# Altium project holoboard.PrjPCB
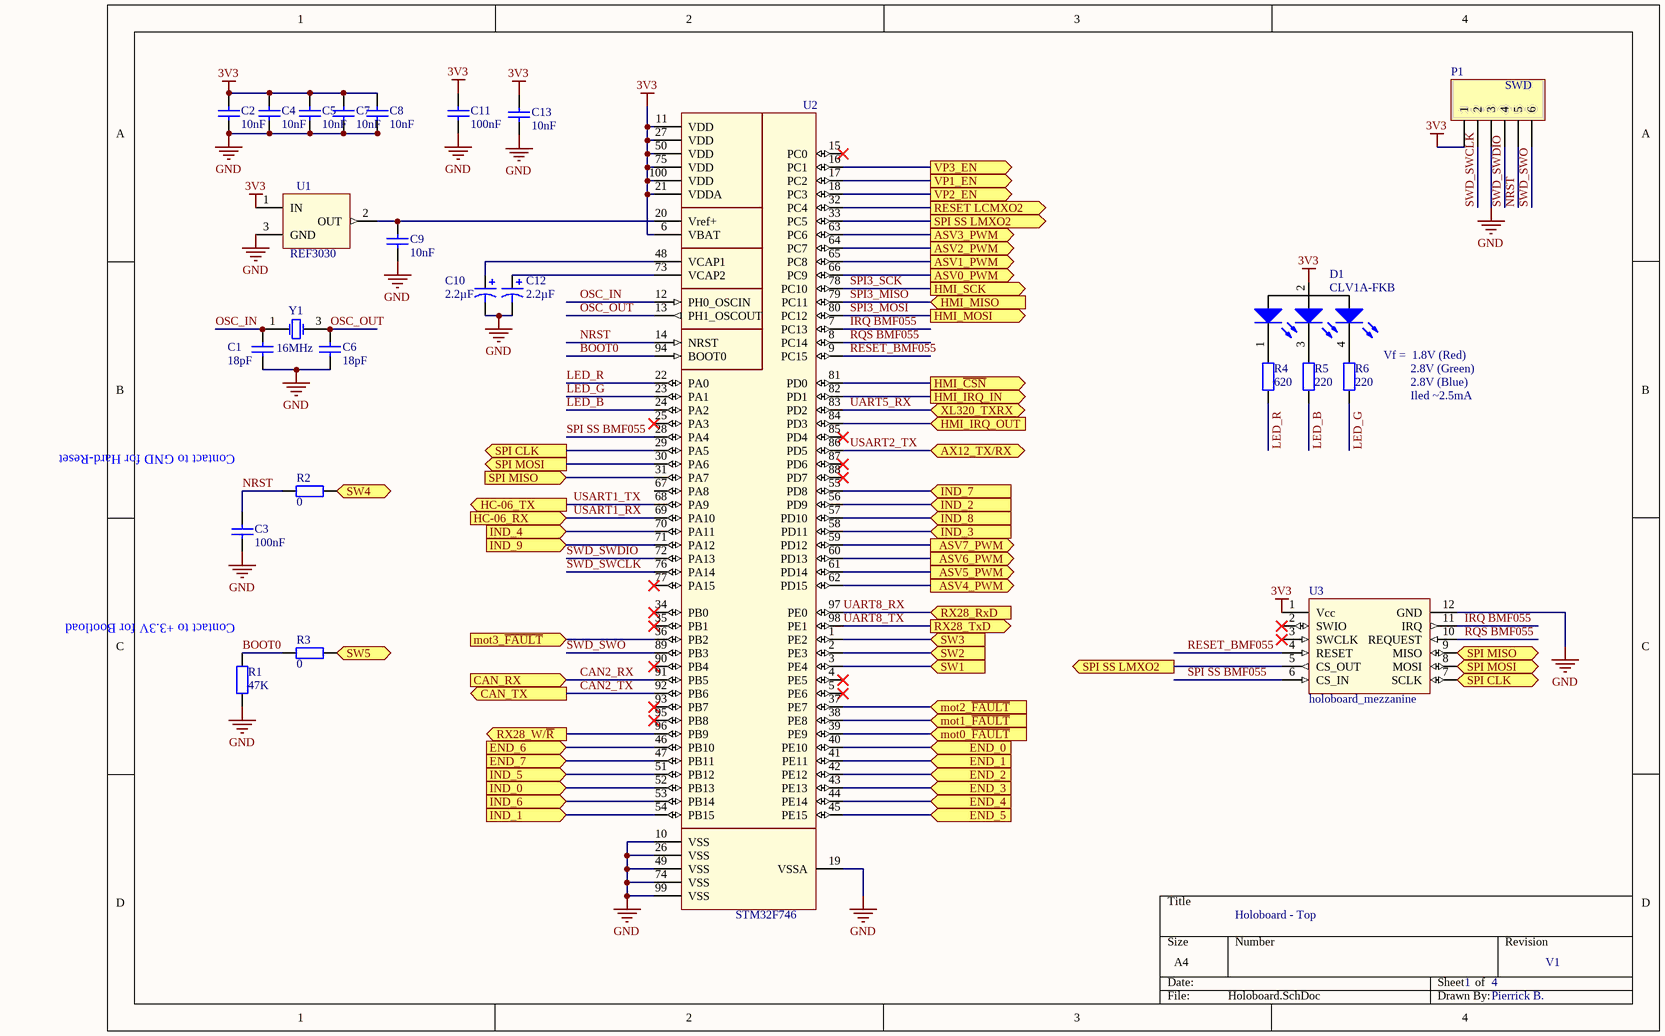
[diagram p0: Holoboard.SchDoc]
4 sheets, 203 parts. Net scope: flat (ports and power ports of the same name join across sheets).
Board file: holoboard.PcbDoc
Sheets:
  Holoboard.SchDoc
  Holoboard_motor_interface.SchDoc
  Holoboard_peripherals.SchDoc
  Holoboard_power_supply.SchDoc

## Sheet Holoboard.SchDoc
size A4

### Parts
C1  value 18pF  [C0603]  (hidden comment: Cap)
C2  value 10nF  [C0603]  (hidden comment: Cap)
C3  value 100nF  [C0603]  (hidden comment: Cap)
C4  value 10nF  [C0603]  (hidden comment: Cap)
C5  value 10nF  [C0603]  (hidden comment: Cap)
C6  value 18pF  [C0603]  (hidden comment: Cap)
C7  value 10nF  [C0603]  (hidden comment: Cap)
C8  value 10nF  [C0603]  (hidden comment: Cap)
C9  value 10nF  [C0603]  (hidden comment: Cap)
C10  value 2.2µF  [Boitier tantale A]  (hidden comment: Cap Pol)
C11  value 100nF  [C0603]  (hidden comment: Cap)
C12  value 2.2µF  [Boitier tantale A]  (hidden comment: Cap Pol)
C13  value 10nF  [C0603]  (hidden comment: Cap)
D1  CLV1A-FKB  [WL-SFTW SMD]
P1  SWD  [HDR1X6]
R1  value 47K  [0603]  (hidden comment: Res2)
R2  value 0  [0402]  (hidden comment: Res2)
R3  value 0  [0402]  (hidden comment: Res2)
R4  value 620  [0402]  (hidden comment: Res2)
R5  value 220  [0402]  (hidden comment: Res2)
R6  value 220  [0402]  (hidden comment: Res2)
U1  REF3030  [SOT-23]
U2  STM32F746  [LQFP100]
U3  holoboard_mezzanine  [holoboard_mezzanine]
Y1  16MHz  [QC3CA]

### Ports
ASV0_PWM (out), ASV1_PWM (out), ASV2_PWM (out), ASV3_PWM (out), ASV4_PWM (out), ASV5_PWM (out), ASV6_PWM (out), ASV7_PWM (out), AX12_TX/RX (bidir), CAN_RX (in), CAN_TX (out), END_0 (in), END_1 (in), END_2 (in), END_3 (in), END_4 (in), END_5 (in), END_6 (in), END_7 (in), HC-06_RX (in), HC-06_TX (out), HMI_IRQ_IN (out), HMI_IRQ_OUT (in), HMI_MISO (in), HMI_MOSI (out), HMI_SCK (out), HMI_~{CSN} (out), IND_0 (in), IND_1 (in), IND_2 (in), IND_3 (in), IND_4 (in), IND_5 (in), IND_6 (in), IND_7 (in), IND_8 (in), IND_9 (in), mot0_~{FAULT} (in), mot1_~{FAULT} (in), mot2_~{FAULT} (in), mot3_~{FAULT} (in), RESET LCMXO2 (out), RX28_RxD (in), RX28_TxD (out), RX28_W/~{R} (out), SPI CLK (in), SPI CLK (out), SPI MISO (in), SPI MISO (out), SPI MOSI (in), SPI MOSI (out), SPI SS LMXO2 (out), SW1 (in), SW2 (in), SW3 (in), SW4 (in), SW5 (in), VP1_EN (out), VP2_EN (out), VP3_EN (out), XL320_TXRX (bidir)

### Nets
3V3: C2.2 C4.2 C5.2 C7.2 C8.2 C11.2 C13.2 D1.2(A) P1.1 U1.1(IN) U2.6(VBAT) U2.11(VDD) U2.21(VDDA) U2.27(VDD) U2.50(VDD) U2.75(VDD) U2.100(VDD) U3.1(Vcc)
GND: C1.1 C2.1 C3.1 C4.1 C5.1 C6.1 C7.1 C8.1 C9.1 C10.2 C11.1 C12.2 C13.1 P1.3 R1.1 U1.3(GND) U2.10(VSS) U2.19(VSSA) U2.26(VSS) U2.49(VSS) U2.74(VSS) U2.99(VSS) U3.12(GND)
BOOT0: R1.2 R3.2 U2.94(BOOT0)
CAN2_RX: U2.91(PB5) ; port CAN_RX
CAN2_TX: U2.92(PB6) ; port CAN_TX
IRQ BMF055: U2.7(PC13) U3.11(IRQ)
LED_B: R5.1 U2.24(PA2)
LED_G: R6.1 U2.23(PA1)
LED_R: R4.2 U2.22(PA0)
NRST: C3.2 P1.5 R2.2 U2.14(NRST)
OSC_IN: C1.2 U2.12(PH0_OSCIN) Y1.1(OSC1)
OSC_OUT: C6.2 U2.13(PH1_OSCOUT) Y1.3(OSC2)
RESET_BMF055: U2.9(PC15) U3.4(RESET)
RQS BMF055: U2.8(PC14) U3.10(REQUEST)
SPI3_MISO: U2.79(PC11) ; port HMI_MISO
SPI3_MOSI: U2.80(PC12) ; port HMI_MOSI
SPI3_SCK: U2.78(PC10) ; port HMI_SCK
SPI SS BMF055: U2.28(PA4) U3.6(CS_IN)
SWD_SWCLK: P1.2 U2.76(PA14)
SWD_SWDIO: P1.4 U2.72(PA13)
SWD_SWO: P1.6 U2.89(PB3)
UART5_RX: U2.83(PD2) ; port XL320_TXRX
UART8_RX: U2.97(PE0) ; port RX28_RxD
UART8_TX: U2.98(PE1) ; port RX28_TxD
USART1_RX: U2.69(PA10) ; port HC-06_RX
USART1_TX: U2.68(PA9) ; port HC-06_TX
USART2_TX: U2.86(PD5) ; port AX12_TX/RX
NetC9_2: C9.2 U1.2(OUT) U2.20(Vref+)
NetC10_1: C10.1 U2.48(VCAP1)
NetC12_1: C12.1 U2.73(VCAP2)
NetD1_1: D1.1(R) R4.1
NetD1_3: D1.3(B) R5.2
NetD1_4: D1.4(G) R6.2
NetP18_2: U2.81(PD0) ; port HMI_~{CSN}
NetP18_3: U2.3(PE4) ; port SW1
NetP18_5: U2.2(PE3) ; port SW2
NetP18_7: U2.1(PE2) ; port SW3
NetP18_9: R2.1 ; port SW4
NetP18_10: U2.82(PD1) ; port HMI_IRQ_IN
NetP18_11: R3.1 ; port SW5
NetP18_12: U2.84(PD3) ; port HMI_IRQ_OUT
NetP24_4: U2.40(PE10) ; port END_0
NetP25_4: U2.41(PE11) ; port END_1
NetP26_4: U2.42(PE12) ; port END_2
NetP27_4: U2.43(PE13) ; port END_3
NetP28_4: U2.44(PE14) ; port END_4
NetP29_4: U2.45(PE15) ; port END_5
NetP30_4: U2.46(PB10) ; port END_6
NetP31_4: U2.47(PB11) ; port END_7
NetQ1_1: U2.17(PC2) ; port VP1_EN
NetQ2_1: U2.18(PC3) ; port VP2_EN
NetQ3_1: U2.16(PC1) ; port VP3_EN
NetR7_1: U2.39(PE9) ; port mot0_~{FAULT}
NetR8_1: U2.38(PE8) ; port mot1_~{FAULT}
NetR9_1: U2.37(PE7) ; port mot2_~{FAULT}
NetR10_1: U2.36(PB2) ; port mot3_~{FAULT}
NetR20_2: U2.52(PB13) ; port IND_0
NetR21_2: U2.54(PB15) ; port IND_1
NetR22_2: U2.56(PD9) ; port IND_2
NetR23_2: U2.58(PD11) ; port IND_3
NetR24_2: U2.70(PA11) ; port IND_4
NetR30_2: U2.51(PB12) ; port IND_5
NetR31_2: U2.53(PB14) ; port IND_6
NetR32_2: U2.55(PD8) ; port IND_7
NetR33_2: U2.57(PD10) ; port IND_8
NetR34_2: U2.71(PA12) ; port IND_9
NetR36_1: U2.66(PC9) ; port ASV0_PWM
NetR37_1: U2.65(PC8) ; port ASV1_PWM
NetR38_1: U2.64(PC7) ; port ASV2_PWM
NetR39_1: U2.63(PC6) ; port ASV3_PWM
NetR41_1: U2.62(PD15) ; port ASV4_PWM
NetR42_1: U2.61(PD14) ; port ASV5_PWM
NetR43_1: U2.60(PD13) ; port ASV6_PWM
NetR44_1: U2.59(PD12) ; port ASV7_PWM
NetR57_1: U2.33(PC5) U3.5(CS_OUT) ; port SPI SS LMXO2
NetU2_29: U2.29(PA5) U3.7(SCLK) ; port SPI CLK
NetU2_30: U2.30(PA6) U3.8(MOSI) ; port SPI MOSI
NetU2_31: U2.31(PA7) U3.9(MISO) ; port SPI MISO
NetU2_32: U2.32(PC4) ; port RESET LCMXO2
NetU2_96: U2.96(PB9) ; port RX28_W/~{R}

Not connected (* = marked no-connect by the designer): U2 4(PE5)* 5(PE6)* 15(PC0)* 25(PA3)* 34(PB0)* 35(PB1)* 67(PA8) 77(PA15)* 85(PD4)* 87(PD6)* 88(PD7)* 90(PB4)* 93(PB7)* 95(PB8)*; U3 2(SWIO)* 3(SWCLK)*; Y1 2 4

### Notes on the sheet
- Vf =  1.8V (Red)
- 2.8V (Green)
- 2.8V (Blue)
- (near R2) Contact to GND for Hard-Reset
- Iled ~2.5mA
- Contact to +3.3V for Bootload
- Holoboard - Top
- 1
- 4
- V1
- Pierrick B.

### Library data of the parts
C1-C9 C11 C13 = Cap: Capacitor; Published: 8-Jun-2000; LatestRevisionDate: 17-Jul-2002; LatestRevisionNote: Re-released for DXP Platform.; PackageReference: RAD-0.3; Publisher: Altium Limited; Supplier: FARNELL
C10 C12 = Cap Pol: Polarized Capacitor; Published: 8-Jun-2000; LatestRevisionDate: 17-Jul-2002; LatestRevisionNote: Re-released for DXP Platform.; PackageReference: POLAR0.8; Publisher: Altium Limited; Supplier: FARNELL
P1 = Header 6: Header, 6-Pin; Supplie: FARNELL
R1-R6 = Res2: Resistor; Published: 8-Jun-2000; LatestRevisionDate: 17-Jul-2002; LatestRevisionNote: Re-released for DXP Platform.; PackageReference: AXIAL-0.4; Publisher: Altium Limited; Supplier: FARNELL
Y1 = XTAL_4pins: Crystal Oscillator; Published: 8-Jun-2000; LatestRevisionDate: 17-Jul-2002; LatestRevisionNote: Re-released for DXP Platform.; PackageReference: R38; Publisher: Altium Limited; Supplier: FARNELL

## Sheet Holoboard_motor_interface.SchDoc
size A3
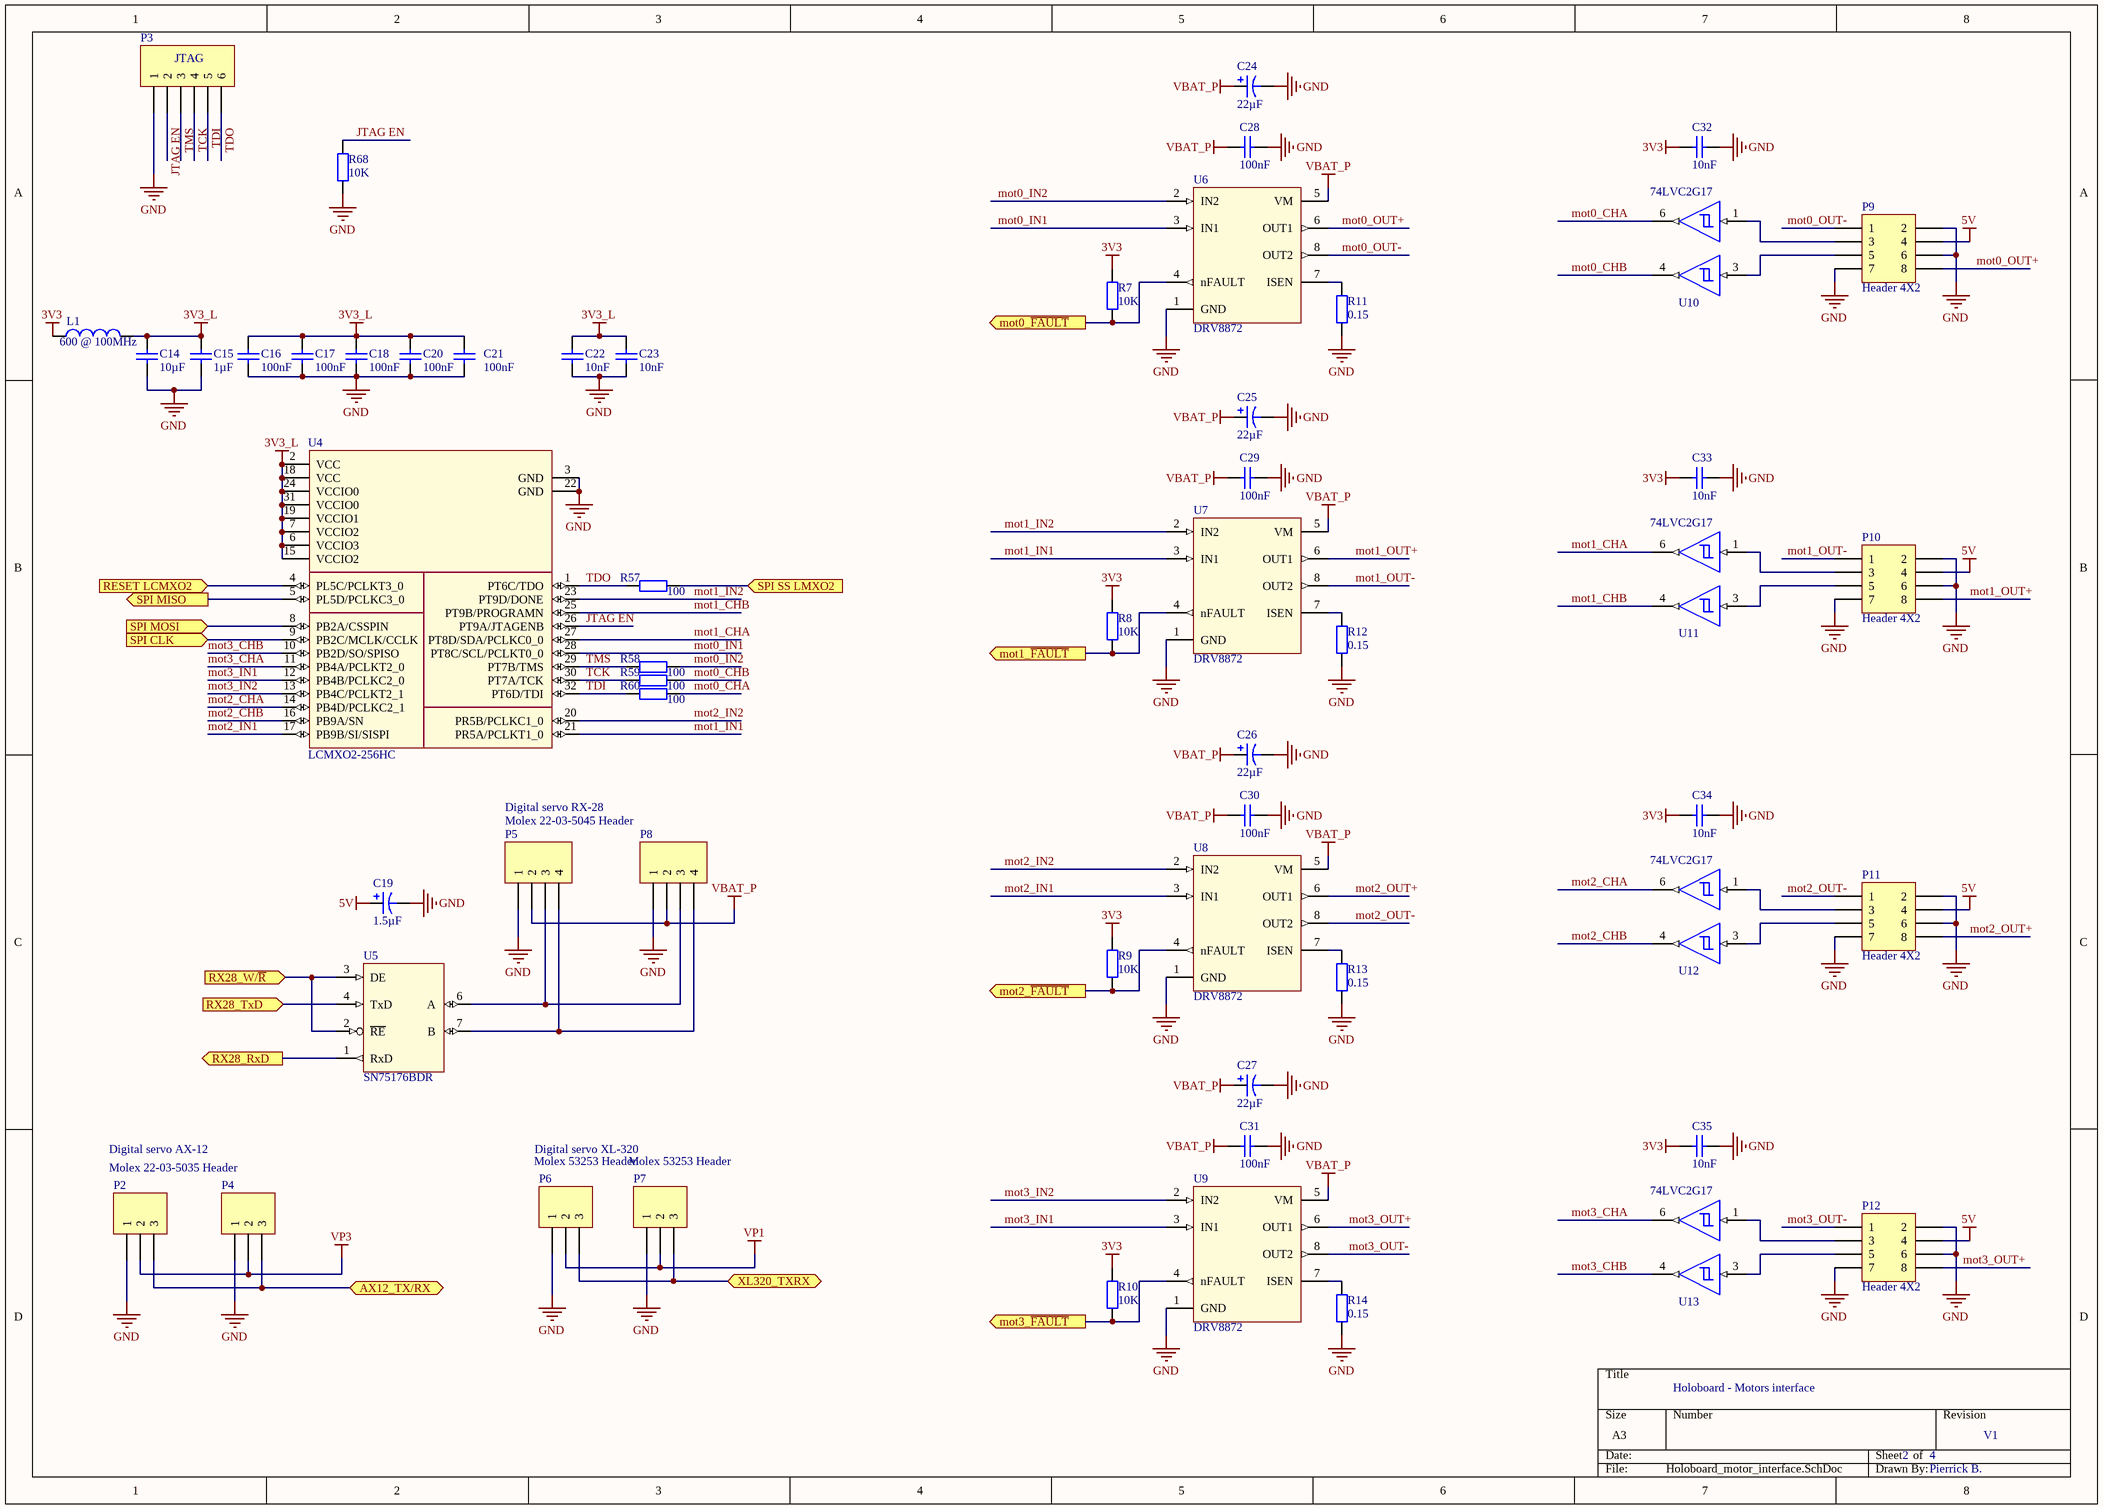
[diagram p1: Holoboard_motor_interface.SchDoc]

### Parts
C14  value 10µF  [C0805]  (hidden comment: Cap)
C15  value 1µF  [C0603]  (hidden comment: Cap)
C16  value 100nF  [C0603]  (hidden comment: Cap)
C17  value 100nF  [C0603]  (hidden comment: Cap)
C18  value 100nF  [C0603]  (hidden comment: Cap)
C19  value 1.5µF  [Boitier tantale A]  (hidden comment: Cap Pol)
C20  value 100nF  [C0603]  (hidden comment: Cap)
C21  value 100nF  [C0603]  (hidden comment: Cap)
C22  value 10nF  [C0603]  (hidden comment: Cap)
C23  value 10nF  [C0603]  (hidden comment: Cap)
C24  value 22µF  [Boitier tantale B]  (hidden comment: Cap Pol)
C25  value 22µF  [Boitier tantale B]  (hidden comment: Cap Pol)
C26  value 22µF  [Boitier tantale B]  (hidden comment: Cap Pol)
C27  value 22µF  [Boitier tantale B]  (hidden comment: Cap Pol)
C28  value 100nF  [C0603]  (hidden comment: Cap)
C29  value 100nF  [C0603]  (hidden comment: Cap)
C30  value 100nF  [C0603]  (hidden comment: Cap)
C31  value 100nF  [C0603]  (hidden comment: Cap)
C32  value 10nF  [C0603]  (hidden comment: Cap)
C33  value 10nF  [C0603]  (hidden comment: Cap)
C34  value 10nF  [C0603]  (hidden comment: Cap)
C35  value 10nF  [C0603]  (hidden comment: Cap)
L1  value 600 @ 100MHz  [0805]  (hidden comment: Inductor)
P2  Molex 22-03-5035 Header  [22-03-5035]
P3  JTAG  [minitek127-6way]
P4  Molex 22-03-5035 Header  [22-03-5035]  (value not drawn)
P5  Molex 22-03-5045 Header  [22-03-5045]
P6  Molex 53253 Header  [53253-0370]
P7  Molex 53253 Header  [53253-0370]
P8  Header 4  [22-03-5045]  (value not drawn)
P9  Header 4X2  [114-15030]
P10  Header 4X2  [114-15030]
P11  Header 4X2  [114-15030]
P12  Header 4X2  [114-15030]
R7  value 10K  [0603]  (hidden comment: Res2)
R8  value 10K  [0603]  (hidden comment: Res2)
R9  value 10K  [0603]  (hidden comment: Res2)
R10  value 10K  [0603]  (hidden comment: Res2)
R11  value 0.15  [2510]  (hidden comment: Res2)
R12  value 0.15  [2510]  (hidden comment: Res2)
R13  value 0.15  [2510]  (hidden comment: Res2)
R14  value 0.15  [2510]  (hidden comment: Res2)
R57  value 100  [0603]  (hidden comment: Res2)
R58  value 100  [0603]  (hidden comment: Res2)
R59  value 100  [0603]  (hidden comment: Res2)
R60  value 100  [0603]  (hidden comment: Res2)
R68  value 10K  [0603]  (hidden comment: Res2)
U4  LCMXO2-256HC  [QFN32]
U5  SN75176BDR  [SOIC150-8]
U6  DRV8872  [DDA]
U7  DRV8872  [DDA]
U8  DRV8872  [DDA]
U9  DRV8872  [DDA]
U10  74LVC2G17  [SOT457]
U11  74LVC2G17  [SOT457]
U12  74LVC2G17  [SOT457]
U13  74LVC2G17  [SOT457]

### Ports
AX12_TX/RX (bidir), mot0_~{FAULT} (out), mot1_~{FAULT} (out), mot2_~{FAULT} (out), mot3_~{FAULT} (out), RESET LCMXO2 (in), RX28_RxD (out), RX28_TxD (in), RX28_W/~{R} (in), SPI CLK (in), SPI MISO (out), SPI MOSI (in), SPI SS LMXO2 (in), XL320_TXRX (bidir)

### Nets
3V3: C32.1 C33.1 C34.1 C35.1 L1.1 R7.2 R8.2 R9.2 R10.2 U10.5(Vcc) U11.5(Vcc) U12.5(Vcc) U13.5(Vcc)
3V3_L: C14.2 C15.2 C16.2 C17.2 C18.2 C20.2 C21.2 C22.2 C23.2 L1.2 U4.2(VCC) U4.6(VCCIO3) U4.7(VCCIO2) U4.15(VCCIO2) U4.18(VCC) U4.19(VCCIO1) U4.24(VCCIO0) U4.31(VCCIO0)
5V: C19.1 P9.4 P10.4 P11.4 P12.4 U5.8(VCC)
GND: C14.1 C15.1 C16.1 C17.1 C18.1 C19.2 C20.1 C21.1 C22.1 C23.1 C24.2 C25.2 C26.2 C27.2 C28.2 C29.2 C30.2 C31.2 C32.2 C33.2 C34.2 C35.2 P2.1 P3.1 P4.1 P5.1 P6.1 P7.1 P8.1 P9.2 P9.6 P9.7 P10.2 P10.6 P10.7 P11.2 P11.6 P11.7 P12.2 P12.6 P12.7 R11.1 R12.1 R13.1 R14.1 R68.2 U4.3(GND) U4.22(GND) U5.5(GND) U6.1(GND) U6.PPAD U7.1(GND) U7.PPAD U8.1(GND) U8.PPAD U9.1(GND) U9.PPAD U10.2(GND) U11.2(GND) U12.2(GND) U13.2(GND)
VBAT_P: C24.1 C25.1 C26.1 C27.1 C28.1 C29.1 C30.1 C31.1 P5.2 P8.2 U6.5(VM) U7.5(VM) U8.5(VM) U9.5(VM)
VP1: P6.2 P7.2
VP3: P2.2 P4.2
JTAG EN: P3.2 R68.1 U4.26(PT9A/JTAGENB)
mot0_CHA: R60.1 U10.6(1Y)
mot0_CHB: R59.1 U10.4(2Y)
mot0_IN1: U4.28(PT8C/SCL/PCLKT0_0) U6.3(IN1)
mot0_IN2: R58.1 U6.2(IN2)
mot0_OUT+: P9.8 U6.6(OUT1)
mot0_OUT-: P9.1 U6.8(OUT2)
mot1_CHA: U4.27(PT8D/SDA/PCLKC0_0) U11.6(1Y)
mot1_CHB: U4.25(PT9B/PROGRAMN) U11.4(2Y)
mot1_IN1: U4.21(PR5A/PCLKT1_0) U7.3(IN1)
mot1_IN2: U4.23(PT9D/DONE) U7.2(IN2)
mot1_OUT+: P10.8 U7.6(OUT1)
mot1_OUT-: P10.1 U7.8(OUT2)
mot2_CHA: U4.14(PB4D/PCLKC2_1) U12.6(1Y)
mot2_CHB: U4.16(PB9A/SN) U12.4(2Y)
mot2_IN1: U4.17(PB9B/SI/SISPI) U8.3(IN1)
mot2_IN2: U4.20(PR5B/PCLKC1_0) U8.2(IN2)
mot2_OUT+: P11.8 U8.6(OUT1)
mot2_OUT-: P11.1 U8.8(OUT2)
mot3_CHA: U4.11(PB4A/PCLKT2_0) U13.6(1Y)
mot3_CHB: U4.10(PB2D/SO/SPISO) U13.4(2Y)
mot3_IN1: U4.12(PB4B/PCLKC2_0) U9.3(IN1)
mot3_IN2: U4.13(PB4C/PCLKT2_1) U9.2(IN2)
mot3_OUT+: P12.8 U9.6(OUT1)
mot3_OUT-: P12.1 U9.8(OUT2)
TCK: P3.4 R59.2 U4.30(PT7A/TCK)
TDI: P3.5 R60.2 U4.32(PT6D/TDI)
TDO: P3.6 R57.2 U4.1(PT6C/TDO)
TMS: P3.3 R58.2 U4.29(PT7B/TMS)
UART5_RX: P6.3 P7.3 ; port XL320_TXRX
UART8_RX: U5.1(RxD) ; port RX28_RxD
UART8_TX: U5.4(TxD) ; port RX28_TxD
USART2_TX: P2.3 P4.3 ; port AX12_TX/RX
NetP5_3: P5.3 P8.3 U5.6(A)
NetP5_4: P5.4 P8.4 U5.7(B)
NetP9_3: P9.3 U10.1(1A)
NetP9_5: P9.5 U10.3(2A)
NetP10_3: P10.3 U11.1(1A)
NetP10_5: P10.5 U11.3(2A)
NetP11_3: P11.3 U12.1(1A)
NetP11_5: P11.5 U12.3(2A)
NetP12_3: P12.3 U13.1(1A)
NetP12_5: P12.5 U13.3(2A)
NetR7_1: R7.1 U6.4(nFAULT) ; port mot0_~{FAULT}
NetR8_1: R8.1 U7.4(nFAULT) ; port mot1_~{FAULT}
NetR9_1: R9.1 U8.4(nFAULT) ; port mot2_~{FAULT}
NetR10_1: R10.1 U9.4(nFAULT) ; port mot3_~{FAULT}
NetR11_2: R11.2 U6.7(ISEN)
NetR12_2: R12.2 U7.7(ISEN)
NetR13_2: R13.2 U8.7(ISEN)
NetR14_2: R14.2 U9.7(ISEN)
NetR57_1: R57.1 ; port SPI SS LMXO2
NetU2_29: U4.9(PB2C/MCLK/CCLK) ; port SPI CLK
NetU2_30: U4.8(PB2A/CSSPIN) ; port SPI MOSI
NetU2_31: U4.5(PL5D/PCLKC3_0) ; port SPI MISO
NetU2_32: U4.4(PL5C/PCLKT3_0) ; port RESET LCMXO2
NetU2_96: U5.2(~{RE}) U5.3(DE) ; port RX28_W/~{R}

### Notes on the sheet
- Digital servo RX-28
- Digital servo AX-12
- Digital servo XL-320
- Holoboard - Motors interface
- 2
- 4
- V1
- Pierrick B.

### Library data of the parts
C14-C18 C20-C23 C28-C35 = Cap: Capacitor; Published: 8-Jun-2000; LatestRevisionDate: 17-Jul-2002; LatestRevisionNote: Re-released for DXP Platform.; PackageReference: RAD-0.3; Publisher: Altium Limited; Supplier: FARNELL
C19 C24-C27 = Cap Pol: Polarized Capacitor; Published: 8-Jun-2000; LatestRevisionDate: 17-Jul-2002; LatestRevisionNote: Re-released for DXP Platform.; PackageReference: POLAR0.8; Publisher: Altium Limited; Supplier: FARNELL
L1 = Inductor: Code_IEC: 1005; Published: 8-Jun-2000; LatestRevisionDate: 17-Jul-2002; LatestRevisionNote: Re-released for DXP Platform.; PackageReference: 0402-A; Publisher: Altium Limited; Code_JEITA: 0402
P2 P4 P6 P7 = Header 3: Header, 3-Pin; LatestRevisionDate: 17-Jul-2002; LatestRevisionNote: Re-released for DXP Platform.; Publisher: Altium Limited
P3 = Header 6: Header, 6-Pin; Supplie: FARNELL
P5 P8 = Header 4: Header, 4-Pin; LatestRevisionDate: 17-Jul-2002; LatestRevisionNote: Re-released for DXP Platform.; Publisher: Altium Limited
P9-P12 = Header 4X2: Header, 4-Pin, Dual row; LatestRevisionDate: 17-Jul-2002; LatestRevisionNote: Re-released for DXP Platform.; Publisher: Altium Limited
R7-R14 R57-R60 R68 = Res2: Resistor; Published: 8-Jun-2000; LatestRevisionDate: 17-Jul-2002; LatestRevisionNote: Re-released for DXP Platform.; PackageReference: AXIAL-0.4; Publisher: Altium Limited; Supplier: FARNELL
U6-U9 = DRV8872: 3.6A Brushed  DC Motor  Driver  With Fault Reporting
U10-U13 = 74LVC2G17: Dual non-inverting Schmitt trigger with 5 V tolerant input

## Sheet Holoboard_peripherals.SchDoc
size A3
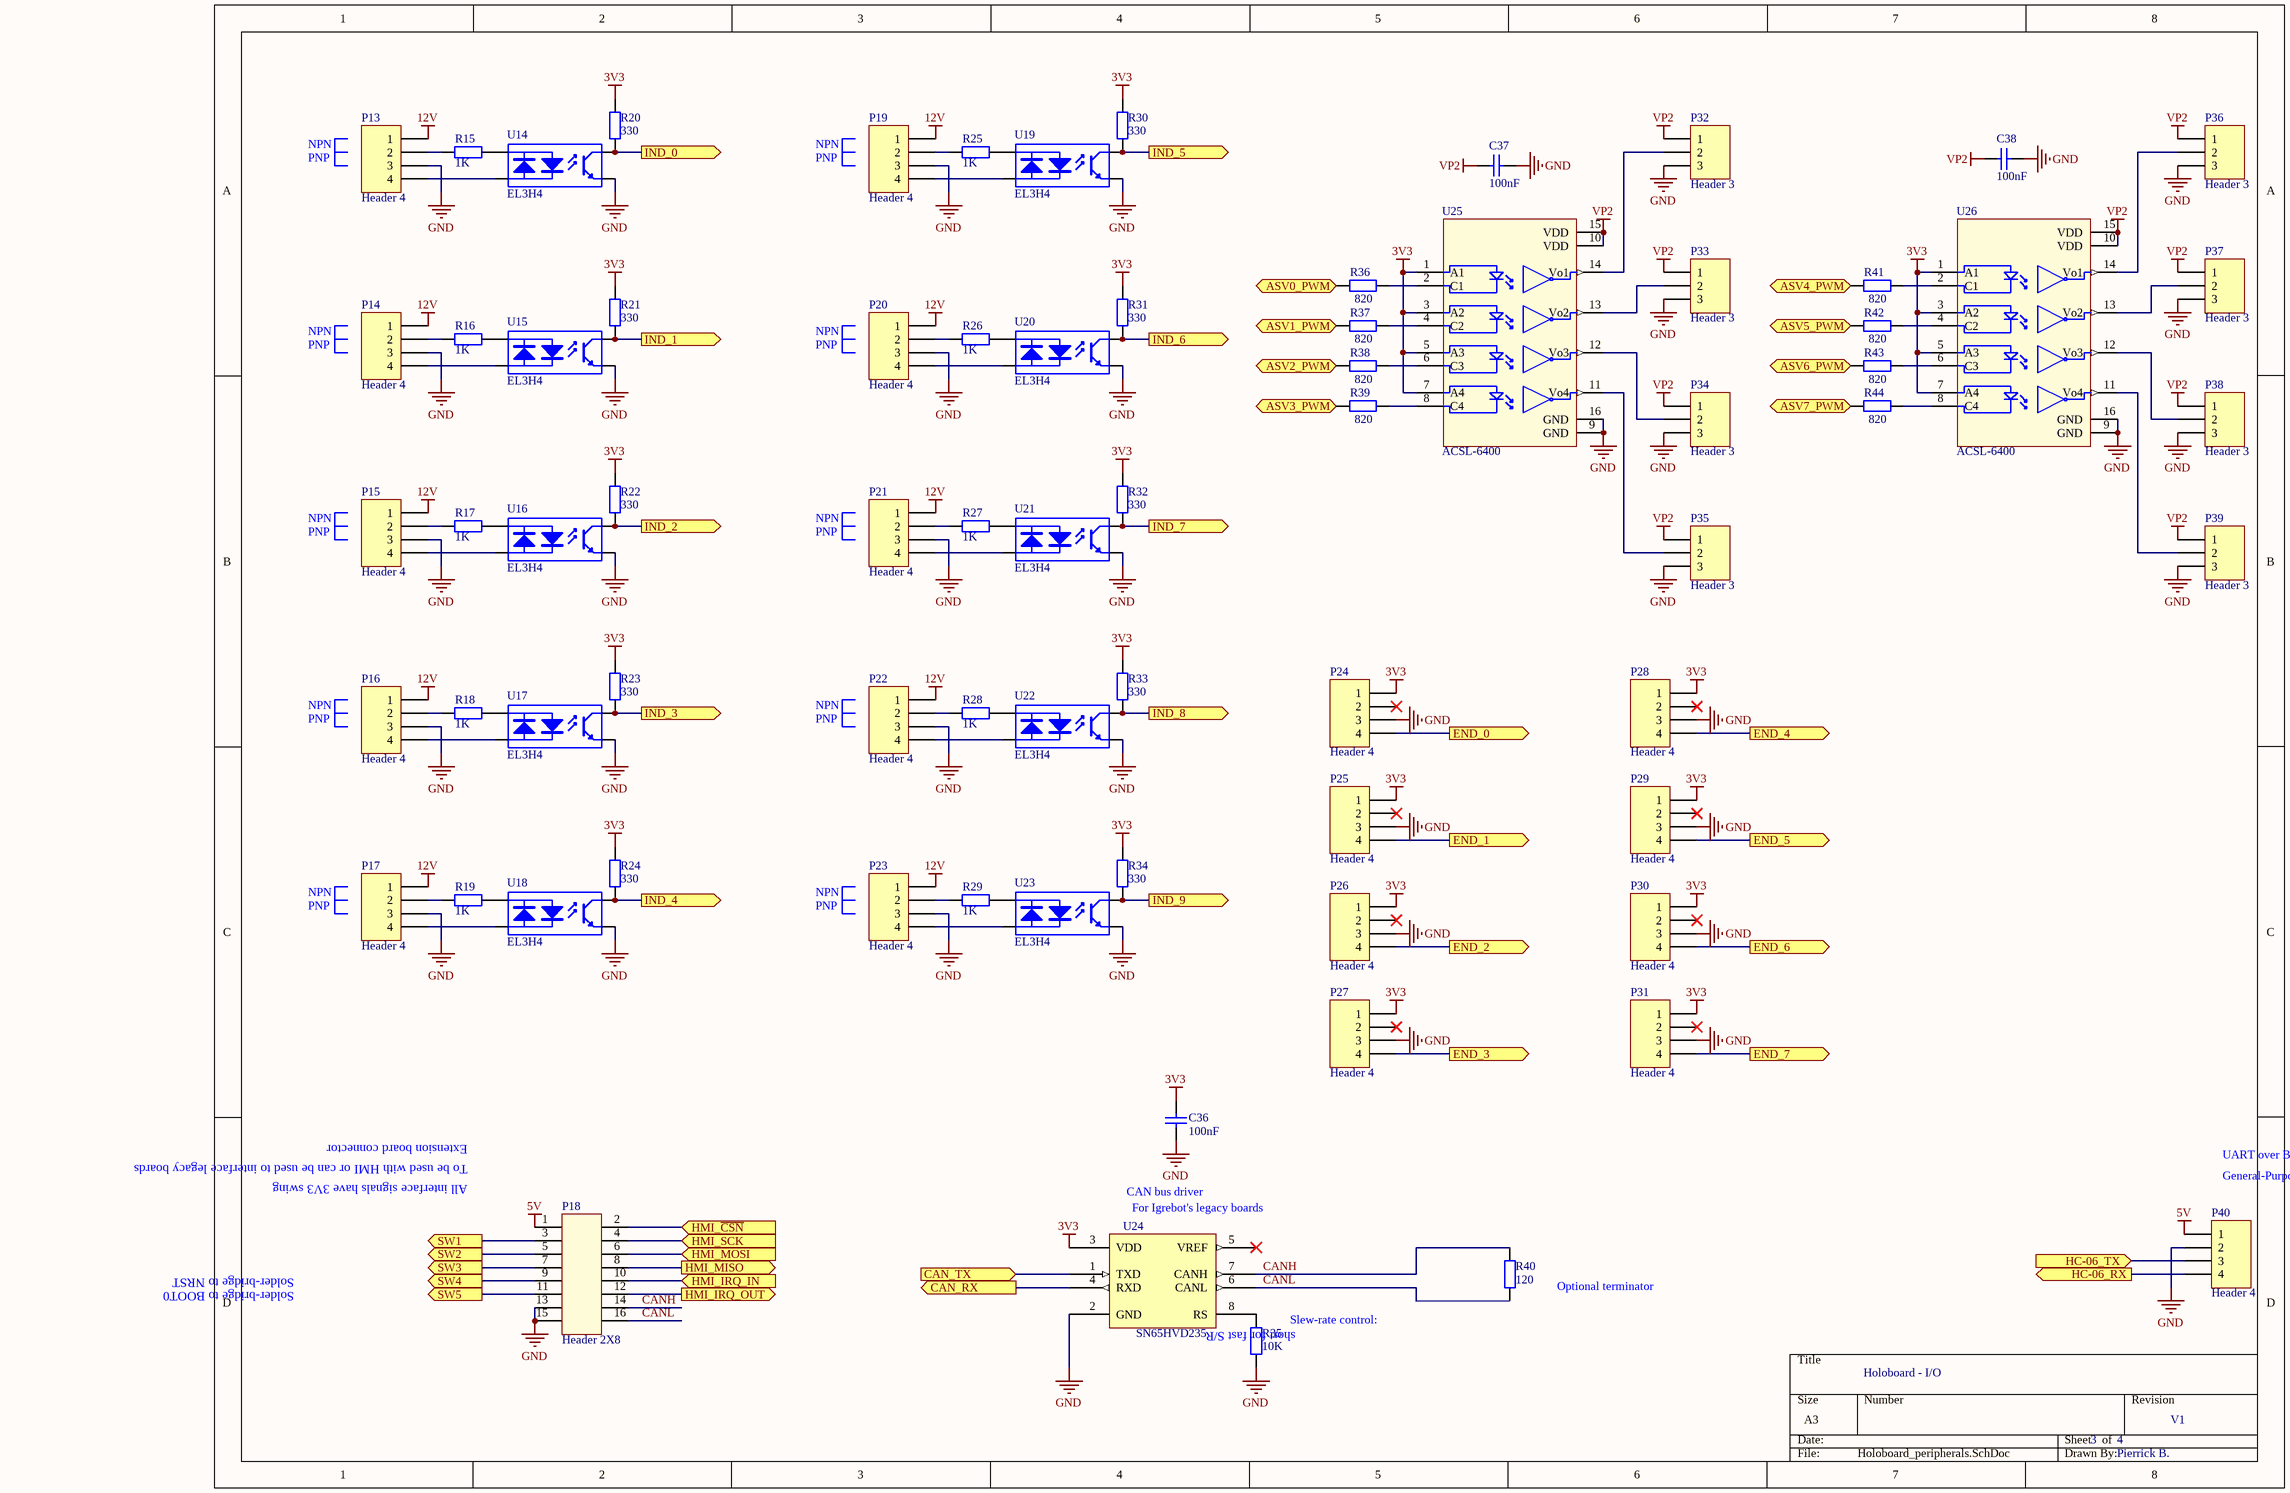
[diagram p2: Holoboard_peripherals.SchDoc]

### Parts
C36  value 100nF  [C0603]  (hidden comment: Cap)
C37  value 100nF  [C0603]  (hidden comment: Cap)
C38  value 100nF  [C0603]  (hidden comment: Cap)
P13  Header 4  [7-215079-4]
P14  Header 4  [7-215079-4]
P15  Header 4  [7-215079-4]
P16  Header 4  [7-215079-4]
P17  Header 4  [7-215079-4]
P18  Header 2X8  [HDR2X8]
P19  Header 4  [7-215079-4]
P20  Header 4  [7-215079-4]
P21  Header 4  [7-215079-4]
P22  Header 4  [7-215079-4]
P23  Header 4  [7-215079-4]
P24  Header 4  [7-215079-4]
P25  Header 4  [7-215079-4]
P26  Header 4  [7-215079-4]
P27  Header 4  [7-215079-4]
P28  Header 4  [7-215079-4]
P29  Header 4  [7-215079-4]
P30  Header 4  [7-215079-4]
P31  Header 4  [7-215079-4]
P32  Header 3  [HDR1X3]
P33  Header 3  [HDR1X3]
P34  Header 3  [HDR1X3]
P35  Header 3  [HDR1X3]
P36  Header 3  [HDR1X3]
P37  Header 3  [HDR1X3]
P38  Header 3  [HDR1X3]
P39  Header 3  [HDR1X3]
P40  Header 4  [HDR1X4]
R15  value 1K  [0603]  (hidden comment: Res2)
R16  value 1K  [0603]  (hidden comment: Res2)
R17  value 1K  [0603]  (hidden comment: Res2)
R18  value 1K  [0603]  (hidden comment: Res2)
R19  value 1K  [0603]  (hidden comment: Res2)
R20  value 330  [0603]  (hidden comment: Res2)
R21  value 330  [0603]  (hidden comment: Res2)
R22  value 330  [0603]  (hidden comment: Res2)
R23  value 330  [0603]  (hidden comment: Res2)
R24  value 330  [0603]  (hidden comment: Res2)
R25  value 1K  [0603]  (hidden comment: Res2)
R26  value 1K  [0603]  (hidden comment: Res2)
R27  value 1K  [0603]  (hidden comment: Res2)
R28  value 1K  [0603]  (hidden comment: Res2)
R29  value 1K  [0603]  (hidden comment: Res2)
R30  value 330  [0603]  (hidden comment: Res2)
R31  value 330  [0603]  (hidden comment: Res2)
R32  value 330  [0603]  (hidden comment: Res2)
R33  value 330  [0603]  (hidden comment: Res2)
R34  value 330  [0603]  (hidden comment: Res2)
R35  value 10K  [0603]  (hidden comment: Res2)
R36  value 820  [0603]  (hidden comment: Res2)
R37  value 820  [0603]  (hidden comment: Res2)
R38  value 820  [0603]  (hidden comment: Res2)
R39  value 820  [0603]  (hidden comment: Res2)
R40  value 120  [0603]  (hidden comment: Res2)
R41  value 820  [0603]  (hidden comment: Res2)
R42  value 820  [0603]  (hidden comment: Res2)
R43  value 820  [0603]  (hidden comment: Res2)
R44  value 820  [0603]  (hidden comment: Res2)
U14  EL3H4
U15  EL3H4
U16  EL3H4
U17  EL3H4
U18  EL3H4
U19  EL3H4
U20  EL3H4
U21  EL3H4
U22  EL3H4
U23  EL3H4
U24  SN65HVD235  [SOIC150-8]
U25  ACSL-6400  [SO16]
U26  ACSL-6400  [SO16]

### Ports
ASV0_PWM (in), ASV1_PWM (in), ASV2_PWM (in), ASV3_PWM (in), ASV4_PWM (in), ASV5_PWM (in), ASV6_PWM (in), ASV7_PWM (in), CAN_RX (out), CAN_TX (in), END_0 (out), END_1 (out), END_2 (out), END_3 (out), END_4 (out), END_5 (out), END_6 (out), END_7 (out), HC-06_RX (out), HC-06_TX (in), HMI_IRQ_IN (in), HMI_IRQ_OUT (out), HMI_MISO (out), HMI_MOSI (in), HMI_SCK (in), HMI_~{CSN} (in), IND_0 (out), IND_1 (out), IND_2 (out), IND_3 (out), IND_4 (out), IND_5 (out), IND_6 (out), IND_7 (out), IND_8 (out), IND_9 (out), SW1 (out), SW2 (out), SW3 (out), SW4 (out), SW5 (out)

### Nets
3V3: C36.2 P24.1 P25.1 P26.1 P27.1 P28.1 P29.1 P30.1 P31.1 R20.1 R21.1 R22.1 R23.1 R24.1 R30.1 R31.1 R32.1 R33.1 R34.1 U24.3(VDD) U25.1(A1) U25.3(A2) U25.5(A3) U25.7(A4) U26.1(A1) U26.3(A2) U26.5(A3) U26.7(A4)
5V: P18.1 P40.1
12V: P13.1 P14.1 P15.1 P16.1 P17.1 P19.1 P20.1 P21.1 P22.1 P23.1
GND: C36.1 C37.1 C38.1 P13.3 P14.3 P15.3 P16.3 P17.3 P18.13 P18.15 P19.3 P20.3 P21.3 P22.3 P23.3 P24.3 P25.3 P26.3 P27.3 P28.3 P29.3 P30.3 P31.3 P32.3 P33.3 P34.3 P35.3 P36.3 P37.3 P38.3 P39.3 P40.2 R35.1 U14.3(E) U15.3(E) U16.3(E) U17.3(E) U18.3(E) U19.3(E) U20.3(E) U21.3(E) U22.3(E) U23.3(E) U24.2(GND) U25.9(GND) U25.16(GND) U26.9(GND) U26.16(GND)
VP2: C37.2 C38.2 P32.1 P33.1 P34.1 P35.1 P36.1 P37.1 P38.1 P39.1 U25.10(VDD) U25.15(VDD) U26.10(VDD) U26.15(VDD)
CAN2_RX: U24.4(RXD) ; port CAN_RX
CAN2_TX: U24.1(TXD) ; port CAN_TX
CANH: P18.14 R40.1 U24.7(CANH)
CANL: P18.16 R40.2 U24.6(CANL)
SPI3_MISO: P18.8 ; port HMI_MISO
SPI3_MOSI: P18.6 ; port HMI_MOSI
SPI3_SCK: P18.4 ; port HMI_SCK
USART1_RX: P40.4 ; port HC-06_RX
USART1_TX: P40.3 ; port HC-06_TX
NetP13_2: P13.2 R15.2
NetP13_4: P13.4 U14.2(K)
NetP14_2: P14.2 R16.2
NetP14_4: P14.4 U15.2(K)
NetP15_2: P15.2 R17.2
NetP15_4: P15.4 U16.2(K)
NetP16_2: P16.2 R18.2
NetP16_4: P16.4 U17.2(K)
NetP17_2: P17.2 R19.2
NetP17_4: P17.4 U18.2(K)
NetP18_2: P18.2 ; port HMI_~{CSN}
NetP18_3: P18.3 ; port SW1
NetP18_5: P18.5 ; port SW2
NetP18_7: P18.7 ; port SW3
NetP18_9: P18.9 ; port SW4
NetP18_10: P18.10 ; port HMI_IRQ_IN
NetP18_11: P18.11 ; port SW5
NetP18_12: P18.12 ; port HMI_IRQ_OUT
NetP19_2: P19.2 R25.2
NetP19_4: P19.4 U19.2(K)
NetP20_2: P20.2 R26.2
NetP20_4: P20.4 U20.2(K)
NetP21_2: P21.2 R27.2
NetP21_4: P21.4 U21.2(K)
NetP22_2: P22.2 R28.2
NetP22_4: P22.4 U22.2(K)
NetP23_2: P23.2 R29.2
NetP23_4: P23.4 U23.2(K)
NetP24_4: P24.4 ; port END_0
NetP25_4: P25.4 ; port END_1
NetP26_4: P26.4 ; port END_2
NetP27_4: P27.4 ; port END_3
NetP28_4: P28.4 ; port END_4
NetP29_4: P29.4 ; port END_5
NetP30_4: P30.4 ; port END_6
NetP31_4: P31.4 ; port END_7
NetP32_2: P32.2 U25.14(Vo1)
NetP33_2: P33.2 U25.13(Vo2)
NetP34_2: P34.2 U25.12(Vo3)
NetP35_2: P35.2 U25.11(Vo4)
NetP36_2: P36.2 U26.14(Vo1)
NetP37_2: P37.2 U26.13(Vo2)
NetP38_2: P38.2 U26.12(Vo3)
NetP39_2: P39.2 U26.11(Vo4)
NetR15_1: R15.1 U14.1(A)
NetR16_1: R16.1 U15.1(A)
NetR17_1: R17.1 U16.1(A)
NetR18_1: R18.1 U17.1(A)
NetR19_1: R19.1 U18.1(A)
NetR20_2: R20.2 U14.4(C) ; port IND_0
NetR21_2: R21.2 U15.4(C) ; port IND_1
NetR22_2: R22.2 U16.4(C) ; port IND_2
NetR23_2: R23.2 U17.4(C) ; port IND_3
NetR24_2: R24.2 U18.4(C) ; port IND_4
NetR25_1: R25.1 U19.1(A)
NetR26_1: R26.1 U20.1(A)
NetR27_1: R27.1 U21.1(A)
NetR28_1: R28.1 U22.1(A)
NetR29_1: R29.1 U23.1(A)
NetR30_2: R30.2 U19.4(C) ; port IND_5
NetR31_2: R31.2 U20.4(C) ; port IND_6
NetR32_2: R32.2 U21.4(C) ; port IND_7
NetR33_2: R33.2 U22.4(C) ; port IND_8
NetR34_2: R34.2 U23.4(C) ; port IND_9
NetR35_2: R35.2 U24.8(RS)
NetR36_1: R36.1 ; port ASV0_PWM
NetR36_2: R36.2 U25.2(C1)
NetR37_1: R37.1 ; port ASV1_PWM
NetR37_2: R37.2 U25.4(C2)
NetR38_1: R38.1 ; port ASV2_PWM
NetR38_2: R38.2 U25.6(C3)
NetR39_1: R39.1 ; port ASV3_PWM
NetR39_2: R39.2 U25.8(C4)
NetR41_1: R41.1 ; port ASV4_PWM
NetR41_2: R41.2 U26.2(C1)
NetR42_1: R42.1 ; port ASV5_PWM
NetR42_2: R42.2 U26.4(C2)
NetR43_1: R43.1 ; port ASV6_PWM
NetR43_2: R43.2 U26.6(C3)
NetR44_1: R44.1 ; port ASV7_PWM
NetR44_2: R44.2 U26.8(C4)

Not connected (* = marked no-connect by the designer): P24 2*; P25 2*; P26 2*; P27 2*; P28 2*; P29 2*; P30 2*; P31 2*; U24 5(VREF)*

### Notes on the sheet
- NPN
- PNP
- Extension board connector
- (near P18) To be used with HMI or can be used to interface legacy boards
- (near P18) All interface signals have 3V3 swing
- UART over BLUETOOTH
- (near P40) General-Purpose debug
- CAN bus driver
- (near U24) For Igrebot's legacy boards
- Solder-bridge to NRST
- Solder-bridge to BOOT0
- (near R40) Optional terminator
- (near R35) Slew-rate control:
- (near R35) short for fast S/R
- Holoboard - I/O
- 3
- 4
- V1
- Pierrick B.

### Library data of the parts
C36-C38 = Cap: Capacitor; Published: 8-Jun-2000; LatestRevisionDate: 17-Jul-2002; LatestRevisionNote: Re-released for DXP Platform.; PackageReference: RAD-0.3; Publisher: Altium Limited
P13-P17 P19-P31 P40 = Header 4: Header, 4-Pin; LatestRevisionDate: 17-Jul-2002; LatestRevisionNote: Re-released for DXP Platform.; Publisher: Altium Limited
P32-P39 = Header 3: Header, 3-Pin; LatestRevisionDate: 17-Jul-2002; LatestRevisionNote: Re-released for DXP Platform.; Publisher: Altium Limited
R15-R44 = Res2: Resistor; Published: 8-Jun-2000; LatestRevisionDate: 17-Jul-2002; LatestRevisionNote: Re-released for DXP Platform.; PackageReference: AXIAL-0.4; Publisher: Altium Limited
  R15-R34 R36-R39 R41-R44: Supplier: FARNELL
U14-U23 = EL3H4: 4-Pin Phototransistor, AC input; Published: 24-Mar-1999; LatestRevisionDate: 04-Mar-2005; LatestRevisionNote: Sch pins 3 & 4 Swapped.; DatasheetVersion: Nov-2003; PackageReference: DIP-4; Publisher: Altium Limited
U24 = MCP2551: High Speed Can Transceiver; Published: 6-Oct-2005; DatasheetDocument: Nov-2003; PackageDocument: Oct-2005; PackageReference: SOIC150-8; Publisher: Altium Limited; Code_JEDEC: MS-012; ComponentLink1Description: Manufacturer Link; ComponentLink1URL: http://www.microchip.com; ComponentLink2Description: Datasheet; ComponentLink2URL: http://ww1.microchip.com/downloads/en/DeviceDoc/21667d.pdf

## Sheet Holoboard_power_supply.SchDoc
size A4
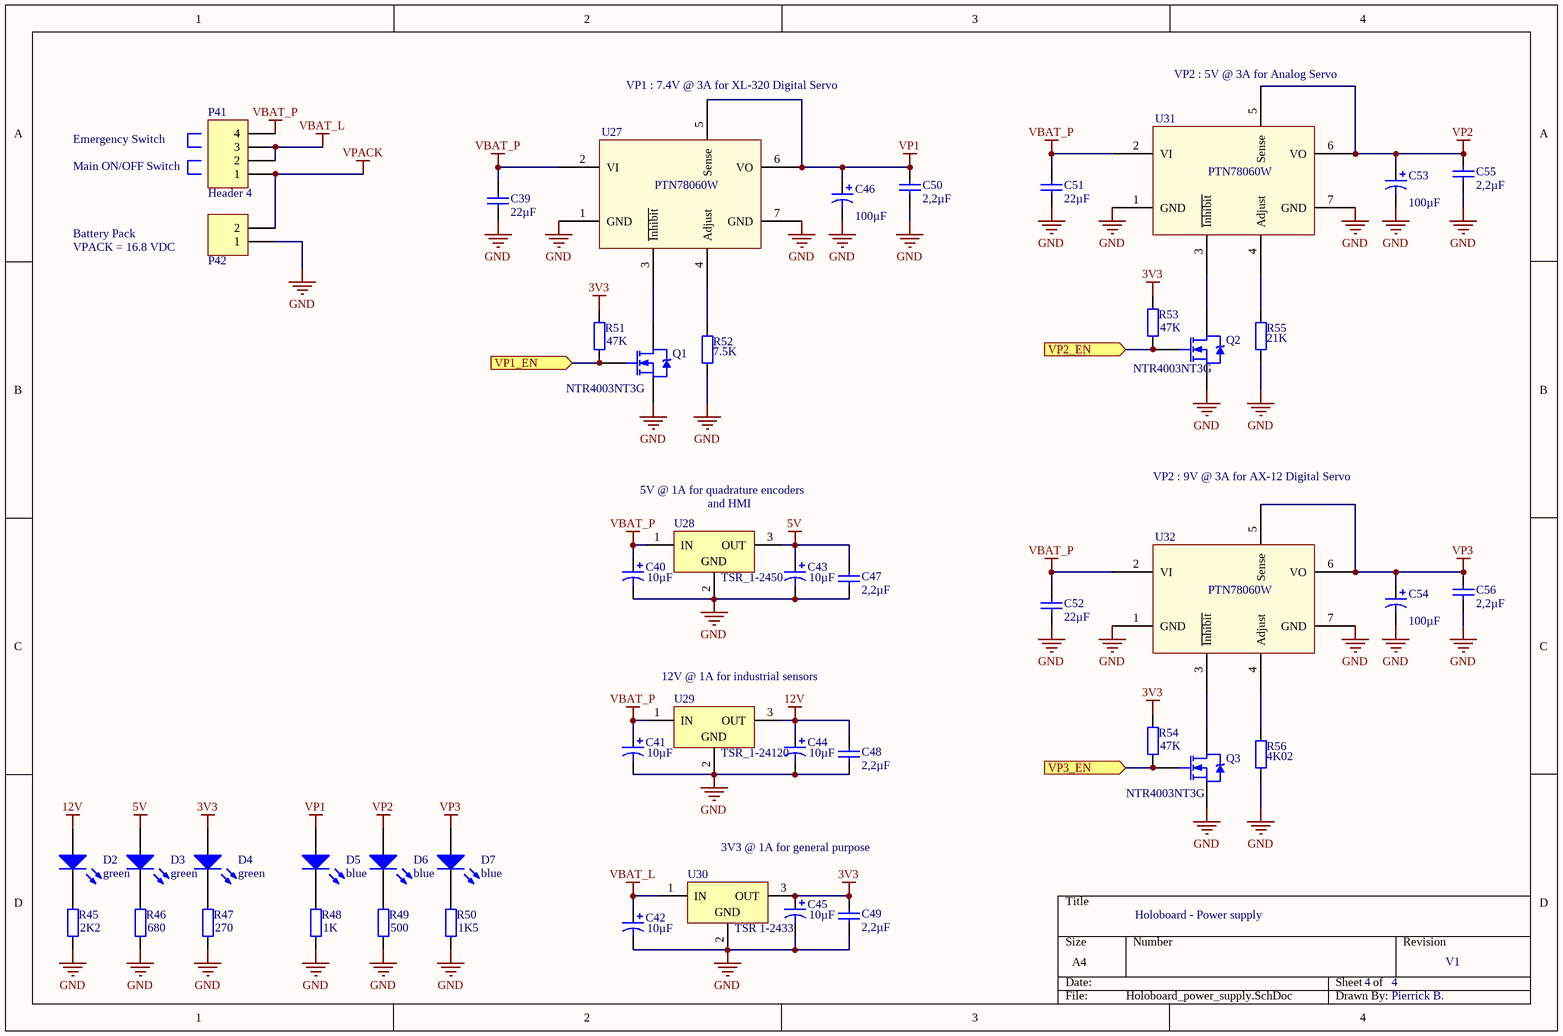
[diagram p3: Holoboard_power_supply.SchDoc]

### Parts
C39  value 22µF  [Boitier tantale B]  (hidden comment: Cap)
C40  value 10µF  [Boitier tantale B]  (hidden comment: Cap Pol)
C41  value 10µF  [Boitier tantale B]  (hidden comment: Cap Pol)
C42  value 10µF  [Boitier tantale B]  (hidden comment: Cap Pol)
C43  value 10µF  [Boitier tantale B]  (hidden comment: Cap Pol)
C44  value 10µF  [Boitier tantale B]  (hidden comment: Cap Pol)
C45  value 10µF  [Boitier tantale B]  (hidden comment: Cap Pol)
C46  value 100µF  [Boitier tantale C]  (hidden comment: Cap Pol)
C47  value 2,2µF  [C0805]  (hidden comment: Cap)
C48  value 2,2µF  [C0805]  (hidden comment: Cap)
C49  value 2,2µF  [C0805]  (hidden comment: Cap)
C50  value 2,2µF  [C0805]  (hidden comment: Cap)
C51  value 22µF  [Boitier tantale B]  (hidden comment: Cap)
C52  value 22µF  [Boitier tantale B]  (hidden comment: Cap)
C53  value 100µF  [Boitier tantale C]  (hidden comment: Cap Pol)
C54  value 100µF  [Boitier tantale C]  (hidden comment: Cap Pol)
C55  value 2,2µF  [C0805]  (hidden comment: Cap)
C56  value 2,2µF  [C0805]  (hidden comment: Cap)
D2  green  [KP-2012]
D3  green  [KP-2012]
D4  green  [KP-2012]
D5  blue  [KP-2012]
D6  blue  [KP-2012]
D7  blue  [KP-2012]
P41  Header 4  [IMO - 20.155MH/4]
P42  Header 2  [IMO - 20.155MH/2]  (value not drawn)
Q1  NTR4003NT3G  [SOT-23]
Q2  NTR4003NT3G  [SOT-23]
Q3  NTR4003NT3G  [SOT-23]
R45  value 2K2  [0603]  (hidden comment: Res2)
R46  value 680  [0603]  (hidden comment: Res2)
R47  value 270  [0603]  (hidden comment: Res2)
R48  value 1K  [0603]  (hidden comment: Res2)
R49  value 500  [0603]  (hidden comment: Res2)
R50  value 1K5  [0603]  (hidden comment: Res2)
R51  value 47K  [0603]  (hidden comment: Res2)
R52  value 7.5K  [0603]  (hidden comment: Res2)
R53  value 47K  [0603]  (hidden comment: Res2)
R54  value 47K  [0603]  (hidden comment: Res2)
R55  value 21K  [0603]  (hidden comment: Res2)
R56  value 4K02  [0603]  (hidden comment: Res2)
U27  PTN78060W  [EUW]
U28  TSR_1-2450  [TSR-1]
U29  TSR_1-24120  [TSR-1]
U30  TSR 1-2433  [TSR-1]
U31  PTN78060W  [EUW]
U32  PTN78060W  [EUW]

### Ports
VP1_EN (in), VP2_EN (in), VP3_EN (in)

### Nets
3V3: C45.1 C49.2 D4.1(A) R51.2 R53.2 R54.2 U30.3(OUT)
5V: C43.1 C47.2 D3.1(A) U28.3(OUT)
12V: C44.1 C48.2 D2.1(A) U29.3(OUT)
GND: C39.1 C40.2 C41.2 C42.2 C43.2 C44.2 C45.2 C46.2 C47.1 C48.1 C49.1 C50.1 C51.1 C52.1 C53.2 C54.2 C55.1 C56.1 P42.1 Q1.2(S) Q2.2(S) Q3.2(S) R45.1 R46.1 R47.1 R48.1 R49.1 R50.1 R52.1 R55.1 R56.1 U27.1(GND) U27.7(GND) U28.2(GND) U29.2(GND) U30.2(GND) U31.1(GND) U31.7(GND) U32.1(GND) U32.7(GND)
VBAT_L: C42.1 P41.2 P41.3 U30.1(IN)
VBAT_P: C39.2 C40.1 C41.1 C51.2 C52.2 P41.4 U27.2(VI) U28.1(IN) U29.1(IN) U31.2(VI) U32.2(VI)
VP1: C46.1 C50.2 D5.1(A) U27.5(Sense) U27.6(VO)
VP2: C53.1 C55.2 D6.1(A) U31.5(Sense) U31.6(VO)
VP3: C54.1 C56.2 D7.1(A) U32.5(Sense) U32.6(VO)
VPACK: P41.1 P42.2
NetD2_2: D2.2(K) R45.2
NetD3_2: D3.2(K) R46.2
NetD4_2: D4.2(K) R47.2
NetD5_2: D5.2(K) R48.2
NetD6_2: D6.2(K) R49.2
NetD7_2: D7.2(K) R50.2
NetQ1_1: Q1.1(G) R51.1 ; port VP1_EN
NetQ1_3: Q1.3(D) U27.3(~{Inhibit})
NetQ2_1: Q2.1(G) R53.1 ; port VP2_EN
NetQ2_3: Q2.3(D) U31.3(~{Inhibit})
NetQ3_1: Q3.1(G) R54.1 ; port VP3_EN
NetQ3_3: Q3.3(D) U32.3(~{Inhibit})
NetR52_2: R52.2 U27.4(Adjust)
NetR55_2: R55.2 U31.4(Adjust)
NetR56_2: R56.2 U32.4(Adjust)

### Notes on the sheet
- (near U27) VP1 : 7.4V @ 3A for XL-320 Digital Servo
- (near U31) VP2 : 5V @ 3A for Analog Servo
- Emergency Switch
- Main ON/OFF Switch
- Battery Pack
- VPACK = 16.8 VDC
- 5V @ 1A for quadrature encoders
- (near U28) and HMI
- VP2 : 9V @ 3A for AX-12 Digital Servo
- (near U29) 12V @ 1A for industrial sensors
- 3V3 @ 1A for general purpose
- Holoboard - Power supply
- 4
- V1
- Pierrick B.

### Library data of the parts
C39 C47-C52 C55 C56 = Cap: Capacitor; Published: 8-Jun-2000; LatestRevisionDate: 17-Jul-2002; LatestRevisionNote: Re-released for DXP Platform.; PackageReference: RAD-0.3; Publisher: Altium Limited; Supplier: FARNELL
C40-C46 C53 C54 = Cap Pol: Polarized Capacitor; Published: 8-Jun-2000; LatestRevisionDate: 17-Jul-2002; LatestRevisionNote: Re-released for DXP Platform.; PackageReference: POLAR0.8; Publisher: Altium Limited; Supplier: FARNELL
D2-D7 = LED1: Typical RED GaAs LED; Published: 8-Jun-2000; LatestRevisionDate: 08-Jul-2005; LatestRevisionNote: Mech Layer 1 removed.; PackageReference: LED-1; Publisher: Altium Limited
P41 = Header 4: Header, 4-Pin; LatestRevisionDate: 17-Jul-2002; LatestRevisionNote: Re-released for DXP Platform.; Publisher: Altium Limited
P42 = Header 2: Header, 2-Pin; LatestRevisionDate: 17-Jul-2002; LatestRevisionNote: Re-released for DXP Platform.; Publisher: Altium Limited
Q1-Q3 = NMOS-2: N-Channel Power MOSFET; Note: Pin 2 is electrically connected to pin 4.; Published: 8-Jun-2000; LatestRevisionDate: 17-Jul-2002; LatestRevisionNote: Re-released for DXP Platform.; DatasheetDocument: PD-9.814; PackageReference: TO-220AB; Publisher: Altium Limited; Code_JEDEC: TO-220-AB; ComponentLink1Description: Manufacturer Link; ComponentLink1URL: http://www.irf.com/
R45-R56 = Res2: Resistor; Published: 8-Jun-2000; LatestRevisionDate: 17-Jul-2002; LatestRevisionNote: Re-released for DXP Platform.; PackageReference: AXIAL-0.4; Publisher: Altium Limited; Supplier: FARNELL

## Nets that join several sheets
3V3: Holoboard (18 pins), Holoboard_motor_interface (13 pins), Holoboard_peripherals (28 pins), Holoboard_power_supply (7 pins)
5V: Holoboard_motor_interface (6 pins), Holoboard_peripherals (P18.1 P40.1), Holoboard_power_supply (C43.1 C47.2 D3.1 U28.3)
12V: Holoboard_peripherals (10 pins), Holoboard_power_supply (C44.1 C48.2 D2.1 U29.3)
GND: Holoboard (23 pins), Holoboard_motor_interface (61 pins), Holoboard_peripherals (48 pins), Holoboard_power_supply (40 pins)
VBAT_P: Holoboard_motor_interface (14 pins), Holoboard_power_supply (11 pins)
VP1: Holoboard_motor_interface (P6.2 P7.2), Holoboard_power_supply (5 pins)
VP2: Holoboard_peripherals (14 pins), Holoboard_power_supply (5 pins)
VP3: Holoboard_motor_interface (P2.2 P4.2), Holoboard_power_supply (5 pins)
CAN2_RX: Holoboard (U2.91), Holoboard_peripherals (U24.4)
CAN2_TX: Holoboard (U2.92), Holoboard_peripherals (U24.1)
NetP18_2: Holoboard (U2.81), Holoboard_peripherals (P18.2)
NetP18_3: Holoboard (U2.3), Holoboard_peripherals (P18.3)
NetP18_5: Holoboard (U2.2), Holoboard_peripherals (P18.5)
NetP18_7: Holoboard (U2.1), Holoboard_peripherals (P18.7)
NetP18_9: Holoboard (R2.1), Holoboard_peripherals (P18.9)
NetP18_10: Holoboard (U2.82), Holoboard_peripherals (P18.10)
NetP18_11: Holoboard (R3.1), Holoboard_peripherals (P18.11)
NetP18_12: Holoboard (U2.84), Holoboard_peripherals (P18.12)
NetP24_4: Holoboard (U2.40), Holoboard_peripherals (P24.4)
NetP25_4: Holoboard (U2.41), Holoboard_peripherals (P25.4)
NetP26_4: Holoboard (U2.42), Holoboard_peripherals (P26.4)
NetP27_4: Holoboard (U2.43), Holoboard_peripherals (P27.4)
NetP28_4: Holoboard (U2.44), Holoboard_peripherals (P28.4)
NetP29_4: Holoboard (U2.45), Holoboard_peripherals (P29.4)
NetP30_4: Holoboard (U2.46), Holoboard_peripherals (P30.4)
NetP31_4: Holoboard (U2.47), Holoboard_peripherals (P31.4)
NetQ1_1: Holoboard (U2.17), Holoboard_power_supply (Q1.1 R51.1)
NetQ2_1: Holoboard (U2.18), Holoboard_power_supply (Q2.1 R53.1)
NetQ3_1: Holoboard (U2.16), Holoboard_power_supply (Q3.1 R54.1)
NetR7_1: Holoboard (U2.39), Holoboard_motor_interface (R7.1 U6.4)
NetR8_1: Holoboard (U2.38), Holoboard_motor_interface (R8.1 U7.4)
NetR9_1: Holoboard (U2.37), Holoboard_motor_interface (R9.1 U8.4)
NetR10_1: Holoboard (U2.36), Holoboard_motor_interface (R10.1 U9.4)
NetR20_2: Holoboard (U2.52), Holoboard_peripherals (R20.2 U14.4)
NetR21_2: Holoboard (U2.54), Holoboard_peripherals (R21.2 U15.4)
NetR22_2: Holoboard (U2.56), Holoboard_peripherals (R22.2 U16.4)
NetR23_2: Holoboard (U2.58), Holoboard_peripherals (R23.2 U17.4)
NetR24_2: Holoboard (U2.70), Holoboard_peripherals (R24.2 U18.4)
NetR30_2: Holoboard (U2.51), Holoboard_peripherals (R30.2 U19.4)
NetR31_2: Holoboard (U2.53), Holoboard_peripherals (R31.2 U20.4)
NetR32_2: Holoboard (U2.55), Holoboard_peripherals (R32.2 U21.4)
NetR33_2: Holoboard (U2.57), Holoboard_peripherals (R33.2 U22.4)
NetR34_2: Holoboard (U2.71), Holoboard_peripherals (R34.2 U23.4)
NetR36_1: Holoboard (U2.66), Holoboard_peripherals (R36.1)
NetR37_1: Holoboard (U2.65), Holoboard_peripherals (R37.1)
NetR38_1: Holoboard (U2.64), Holoboard_peripherals (R38.1)
NetR39_1: Holoboard (U2.63), Holoboard_peripherals (R39.1)
NetR41_1: Holoboard (U2.62), Holoboard_peripherals (R41.1)
NetR42_1: Holoboard (U2.61), Holoboard_peripherals (R42.1)
NetR43_1: Holoboard (U2.60), Holoboard_peripherals (R43.1)
NetR44_1: Holoboard (U2.59), Holoboard_peripherals (R44.1)
NetR57_1: Holoboard (U2.33 U3.5), Holoboard_motor_interface (R57.1)
NetU2_29: Holoboard (U2.29 U3.7), Holoboard_motor_interface (U4.9)
NetU2_30: Holoboard (U2.30 U3.8), Holoboard_motor_interface (U4.8)
NetU2_31: Holoboard (U2.31 U3.9), Holoboard_motor_interface (U4.5)
NetU2_32: Holoboard (U2.32), Holoboard_motor_interface (U4.4)
NetU2_96: Holoboard (U2.96), Holoboard_motor_interface (U5.2 U5.3)
SPI3_MISO: Holoboard (U2.79), Holoboard_peripherals (P18.8)
SPI3_MOSI: Holoboard (U2.80), Holoboard_peripherals (P18.6)
SPI3_SCK: Holoboard (U2.78), Holoboard_peripherals (P18.4)
UART5_RX: Holoboard (U2.83), Holoboard_motor_interface (P6.3 P7.3)
UART8_RX: Holoboard (U2.97), Holoboard_motor_interface (U5.1)
UART8_TX: Holoboard (U2.98), Holoboard_motor_interface (U5.4)
USART1_RX: Holoboard (U2.69), Holoboard_peripherals (P40.4)
USART1_TX: Holoboard (U2.68), Holoboard_peripherals (P40.3)
USART2_TX: Holoboard (U2.86), Holoboard_motor_interface (P2.3 P4.3)